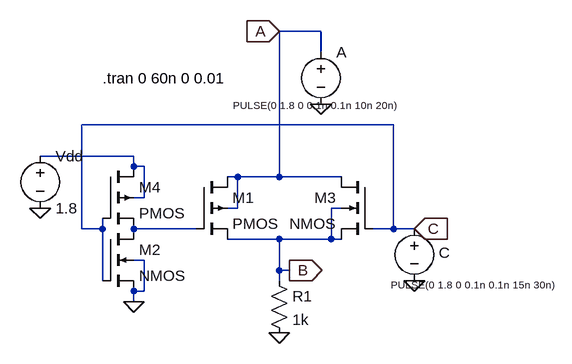
[diagram p0: schematic cmos-transmission-gate.asc]
cmos-transmission-gate.asc, the LTspice schematic file:
Version 4
SHEET 1 1120 680
WIRE 272 -96 208 -96
WIRE 272 -64 272 -96
WIRE 384 48 -96 48
WIRE -16 96 -160 96
WIRE -16 112 -16 96
WIRE 0 112 -16 112
WIRE 144 128 128 128
WIRE 208 128 208 -96
WIRE 208 128 144 128
WIRE 304 128 208 128
WIRE 0 160 0 112
WIRE 0 160 -16 160
WIRE 144 176 144 128
WIRE 144 176 128 176
WIRE 304 176 288 176
WIRE -96 208 -96 48
WIRE -64 208 -64 192
WIRE -64 208 -96 208
WIRE 80 208 -16 208
WIRE 384 208 384 48
WIRE 384 208 352 208
WIRE 416 208 384 208
WIRE 208 224 128 224
WIRE 288 224 288 176
WIRE 288 224 208 224
WIRE 304 224 288 224
WIRE 0 256 -16 256
WIRE 208 272 208 224
WIRE 224 272 208 272
WIRE -64 288 -64 208
WIRE 208 288 208 272
WIRE 0 304 0 256
WIRE 0 304 -16 304
WIRE -16 320 -16 304
FLAG -16 320 0
FLAG 272 16 0
FLAG 416 288 0
FLAG -160 176 0
FLAG 416 208 C
IOPIN 416 208 In
FLAG 224 272 B
IOPIN 224 272 Out
FLAG 208 -96 A
IOPIN 208 -96 In
FLAG 208 368 0
SYMBOL nmos4 352 128 M0
SYMATTR InstName M3
SYMATTR Value2 l=180n w=270n
SYMBOL nmos4 -64 208 R0
SYMATTR InstName M2
SYMATTR Value2 l=180n w=270n
SYMBOL pmos4 -64 112 R0
SYMATTR InstName M4
SYMATTR Value2 l=180n w=810n
SYMBOL voltage 416 192 R0
WINDOW 0 38 53 Left 2
WINDOW 3 -36 102 Left 1
WINDOW 123 0 0 Left 0
WINDOW 39 0 0 Left 0
SYMATTR InstName C
SYMATTR Value PULSE(0 1.8 0 0.1n 0.1n 15n 30n)
SYMBOL voltage -160 80 R0
WINDOW 123 0 0 Left 0
WINDOW 39 0 0 Left 0
SYMATTR InstName Vdd
SYMATTR Value 1.8
SYMBOL voltage 272 -80 R0
WINDOW 3 -135 98 Left 1
WINDOW 123 0 0 Left 0
WINDOW 39 0 0 Left 0
SYMATTR Value PULSE(0 1.8 0 0.1n 0.1n 10n 20n)
SYMATTR InstName A
SYMBOL pmos4 80 128 R0
SYMATTR InstName M1
SYMATTR Value2 l=180n w=810n
SYMBOL res 192 272 R0
SYMATTR InstName R1
SYMATTR Value 1k
TEXT -64 -24 Left 2 !.tran 0 60n 0 0.01

The netlist it stands for:
* cmos-transmission-gate.asc
M3 A C B B NMOS l=180n w=270n
M2 N002 C 0 0 NMOS l=180n w=270n
M4 N001 C N002 N001 PMOS l=180n w=810n
V§C C 0 PULSE(0 1.8 0 0.1n 0.1n 15n 30n)
Vdd N001 0 1.8
V§A A 0 PULSE(0 1.8 0 0.1n 0.1n 10n 20n)
M1 A N002 B A PMOS l=180n w=810n
R1 B 0 1k
.model NMOS NMOS
.model PMOS PMOS
.lib standard.mos
.tran 0 60n 0 0.01
.backanno
.end